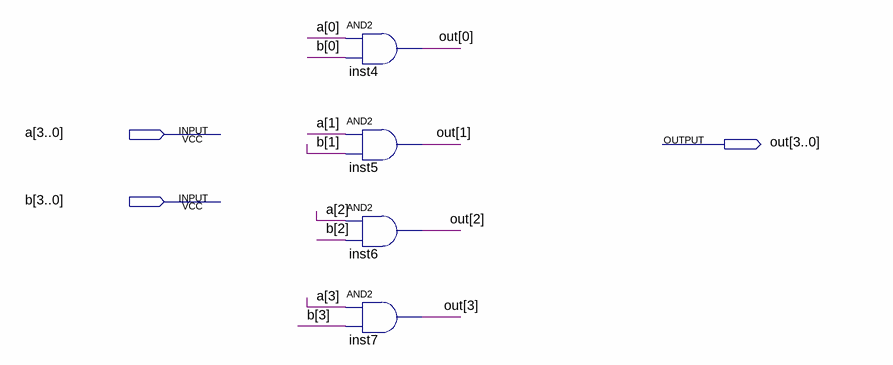
[diagram p0: schematic sheet]
// Quartus schematic and_4bit.bdf as structural Verilog: 4 symbols, 3 pins
module and_4bit (
  input  [3:0] a,
  input  [3:0] b,
  output [3:0] out
);

  and inst4 (out[0], a[0], b[0]);
  and inst5 (out[1], a[1], b[1]);
  and inst6 (out[2], a[2], b[2]);
  and inst7 (out[3], a[3], b[3]);
endmodule
